# EAGLE design combo - no usb (EAGLE 6.5.0)
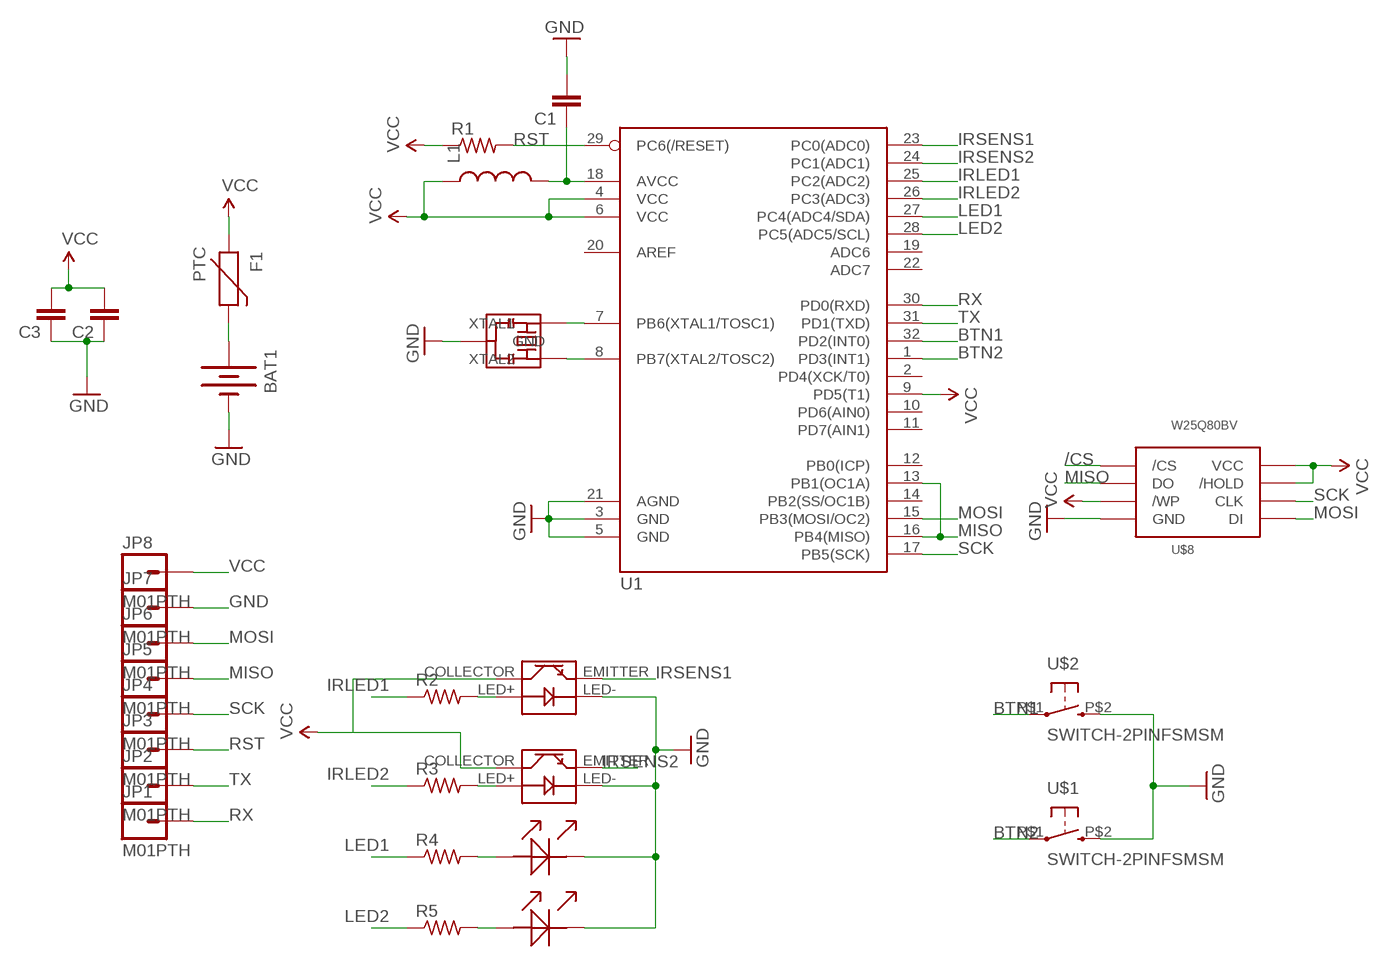
[diagram p0: schematic, sheet 1]

## Parts
BAT1  BATTERYBA2032SM  [BA2032SM]
C1  CAP0805  [0805]
C2  CAP0805  [0805]
C3  CAP0805  [0805]
F1  PTC  [R0805]
JP1  M01PTH  [1X01]
JP2  M01PTH  [1X01]
JP3  M01PTH  [1X01]
JP4  M01PTH  [1X01]
JP5  M01PTH  [1X01]
JP6  M01PTH  [1X01]
JP7  M01PTH  [1X01]
JP8  M01PTH  [1X01]
L1  INDUCTOR0805  [0805]
R1  R-US_M0805  [M0805]
R2  R-US_M0805  [M0805]
R3  R-US_M0805  [M0805]
R4  R-US_M0805  [M0805]
R5  R-US_M0805  [M0805]
U1  ATMEGA328_SMT  [TQFP32-08-THIN]
U$1  SWITCH-2PINFSMSM  [FSMSM-BUTTON]
U$2  SWITCH-2PINFSMSM  [FSMSM-BUTTON]
U$3  IR_SENSORQRE1113  [QRE1113]
U$4  IR_SENSORQRE1113  [QRE1113]
U$5  LED0603  [0603]
U$6  LED0603  [0603]
U$7  RESONATOR_W_CAPS  [AWSCR-CV]
U$8  W25Q80BVSOIC-08  [W25Q80BV-SOIC-208MIL]

## Nets
/CS: U$8./CS
BTN1: U1.32(PD2(INT0)) U$2.P$1
BTN2: U1.1(PD3(INT1)) U$1.P$1
GND: BAT1.- C1.2 C2.1 C3.1 JP7.1 U1.3(GND) U1.5(GND) U1.21(AGND) U$1.P$2 U$2.P$2 U$3.LED- U$4.LED- U$5.2(-) U$6.2(-) U$7.GND U$8.GND
IRLED1: R2.1 U1.25(PC2(ADC2))
IRLED2: R3.1 U1.26(PC3(ADC3))
IRSENS1: U1.23(PC0(ADC0)) U$3.EMITTER
IRSENS2: U1.24(PC1(ADC1)) U$4.EMITTER
LED1: R4.1 U1.27(PC4(ADC4/SDA))
LED2: R5.1 U1.28(PC5(ADC5/SCL))
MISO: JP5.1 U1.13(PB1(OC1A)) U1.16(PB4(MISO)) U$8.DO
MOSI: JP6.1 U1.15(PB3(MOSI/OC2)) U$8.DI
N$1: BAT1.+ F1.2
N$4: U1.7(PB6(XTAL1/TOSC1)) U$7.XTAL1
N$5: U1.8(PB7(XTAL2/TOSC2)) U$7.XTAL2
N$6: C1.1 L1.2 U1.18(AVCC)
N$13: R5.2 U$6.1(+)
N$14: R4.2 U$5.1(+)
N$15: R3.2 U$4.LED+
N$16: R2.2 U$3.LED+
RST: JP3.1 R1.2 U1.29(PC6(/RESET))
RX: JP1.1 U1.30(PD0(RXD))
SCK: JP4.1 U1.17(PB5(SCK)) U$8.CLK
TX: JP2.1 U1.31(PD1(TXD))
VCC: C2.2 C3.2 F1.1 JP8.1 L1.1 R1.1 U1.4(VCC) U1.6(VCC) U1.9(PD5(T1)) U$3.COLLECTOR U$4.COLLECTOR U$8./HOLD U$8./WP U$8.VCC
Unconnected: U1.2(PD4(XCK/T0)) U1.10(PD6(AIN0)) U1.11(PD7(AIN1)) U1.12(PB0(ICP)) U1.14(PB2(SS/OC1B)) U1.19(ADC6) U1.20(AREF) U1.22(ADC7)

## Library data of the parts
BAT1 = Mine:BATTERY: Battery Holders Various common sizes : AA, AAA, 20mm coin cell and 12mm coin cell.
C1-C3 = SparkFun-Capacitors:CAP: Capacitor Standard 0603 ceramic capacitor, and 0.1" leaded capacitor.
F1 = Mine:PTC: Resettable Fuse PTC Resettable Fuse. Spark Fun Electronics SKU : COM-08357
JP1-JP8 = SparkFun-Connectors:M01: Header 1 Standard 1-pin 0.1" header. Use with straight break away headers (SKU : PRT-00116), right angle break away headers (PRT-00553), swiss pins (PRT-00743), machine pins (PRT-00117), and female headers (PRT-00115).
L1 = SparkFun-Passives:INDUCTOR: Inductors Basic Inductor/Choke - 0603 and 1206. Footprints are not proven and vary greatly between part numbers. SRN6045- 33uH, 20% 1.4A SDR0403-560KL - 56uH, 10%, 500mA RMS/740mA peak
R1-R5 = rcl:R-US_: RESISTOR, American symbol
U1 = Mine:ATMEGA328_SMT: 32-Pin Atmega328 part Commonly used on Arduino compatible boards Available in QFP and QFN packages TQFP is IC-09069 QFN is non-stock; PROD_ID: IC-09069; VALUE: ATMEGA328P
U$1 U$2 = Mine:SWITCH-2PIN
U$3 U$4 = Mine:IR_SENSOR
U$5 U$6 = Mine:LED
U$7 = Mine:RESONATOR_W_CAPS
U$8 = Mine:W25Q80BV

## Board
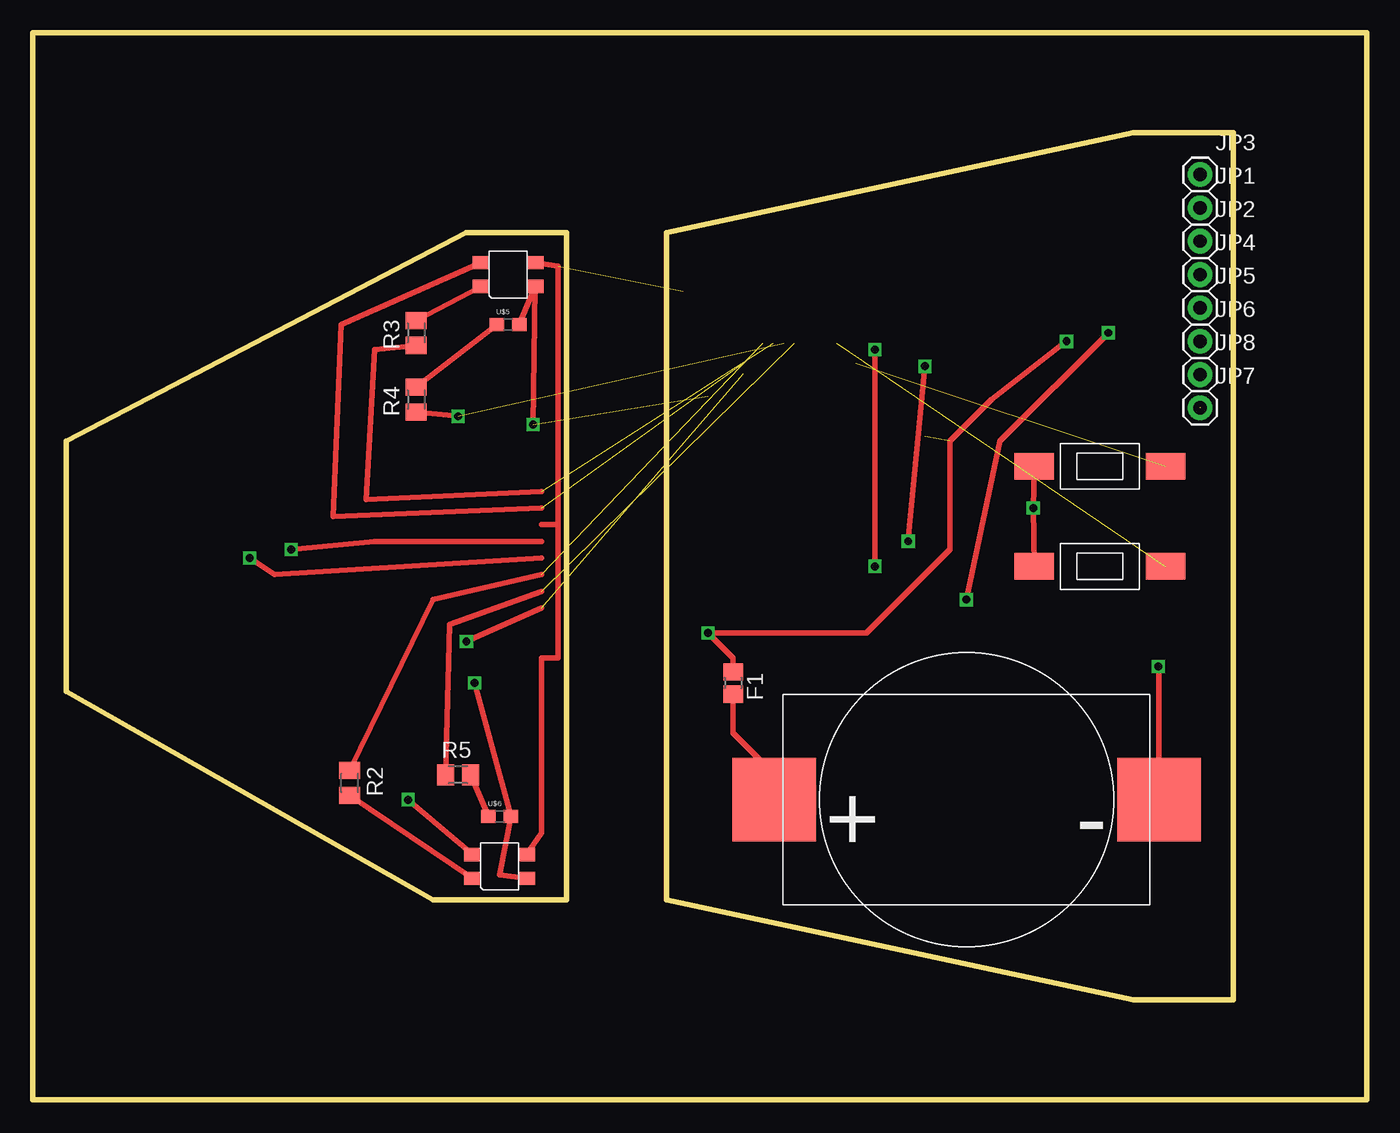
[diagram p1: board, top side]
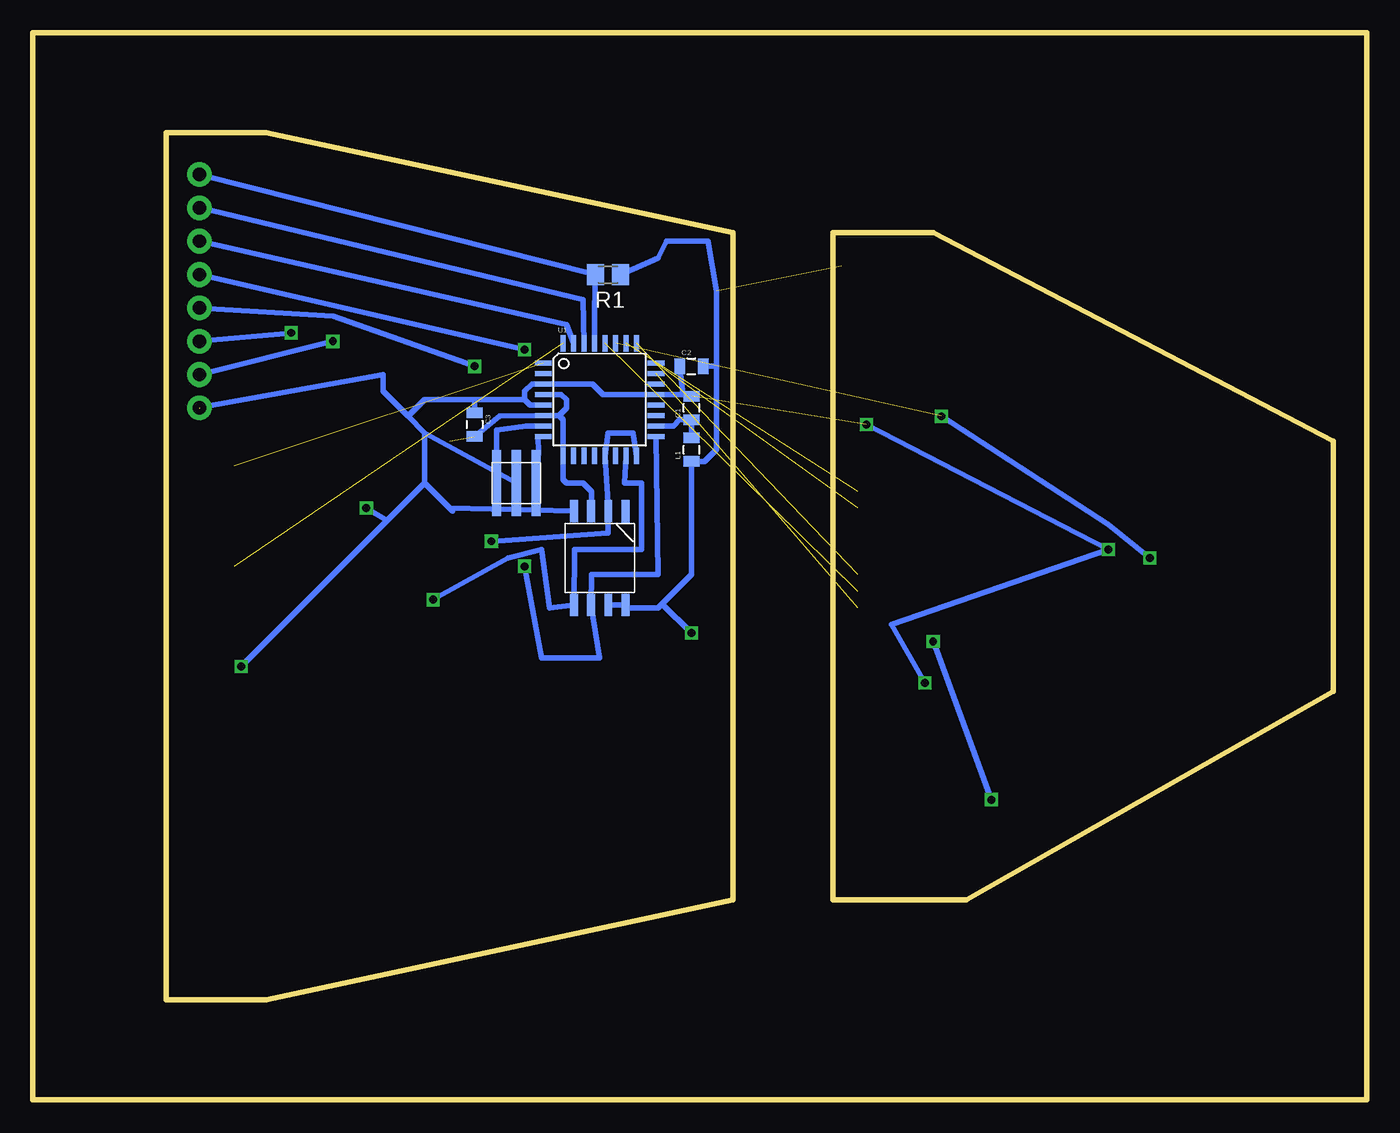
[diagram p2: board, bottom side, seen from below]

Size 101.6 x 81.28 mm. Coordinates in mm from the lower left corner, seen from the top.
Outline: 40.64,66.04 40.64,15.24 30.48,15.24 2.54,31.11 2.54,50.16 33.02,66.04 40.64,66.04
Outline: 48.26,66.04 48.26,15.24 83.82,7.62 91.44,7.62 91.44,73.66 83.82,73.66 48.26,66.04
Outline: 0,0 0,81.28 101.6,81.28 101.6,0 0,0
Copper layers (1*16): Top 0.035mm / dielectric 1.5mm / Bottom 0.035mm
Design rules "default": minimum track width 10mil, minimum drill 24mil, track to track 8mil, track to pad 8mil, pad to pad 8mil, via to via 8mil, smd to smd 8mil, copper to edge 40mil, drill to drill 8mil, minimum pad ring 10mil, minimum via ring 8mil, stop-mask expansion 4mil, vias tented up to drill 0mil, thermal gap 10mil

### Footprints (pad centres in the part's own frame; a part is rotated, then mirrored left to right if it is on the bottom)
BA2032SM = smd 6.35 x 6.35: + 14.656,0; - -14.656,0
0805 = smd 0.8 x 1.2: 1 -0.9,0; 2 0.9,0
R0805 = smd 1.3 x 1.5: 1 -0.85,0; 2 0.85,0
1X01 = drill 1.016 pad 1.88: 1 0,0
M0805 = smd 1.3 x 1.6: 1 -0.95,0; 2 0.95,0
TQFP32-08-THIN = smd 1.27 x 0.381: 1 -4.293,2.8; 2 -4.293,2; 3 -4.293,1.2; 4 -4.293,0.4; 5 -4.293,-0.4; 6 -4.293,-1.2; 7 -4.293,-2; 8 -4.293,-2.8; 17 4.293,-2.8; 18 4.293,-2; 19 4.293,-1.2; 20 4.293,-0.4; 21 4.293,0.4; 22 4.293,1.2; 23 4.293,2; 24 4.293,2.8 | smd 0.381 x 1.27: 9 -2.8,-4.293; 10 -2,-4.293; 11 -1.2,-4.293; 12 -0.4,-4.293; 13 0.4,-4.293; 14 1.2,-4.293; 15 2,-4.293; 16 2.8,-4.293; 25 2.8,4.293; 26 2,4.293; 27 1.2,4.293; 28 0.4,4.293; 29 -0.4,4.293; 30 -1.2,4.293; 31 -2,4.293; 32 -2.8,4.293
FSMSM-BUTTON = smd 3 x 2: P$1 5,0; P$2 -5,0
QRE1113 = smd 1.3 x 1: COLLECTOR 2.05,0.9; EMITTER -2.05,0.9; LED+ -2.05,-0.9; LED- 2.05,-0.9
0603 = smd 1.1 x 1: 1 -0.85,0; 2 0.85,0
AWSCR-CV = smd 0.7 x 5: GND 0,0; XTAL1 -1.5,0; XTAL2 1.5,0
W25Q80BV-SOIC-208MIL = smd 1.7 x 0.605: /CS -3.567,1.965 | smd 1.7 x 0.6: /HOLD 3.575,0.655; /WP -3.575,-0.655; CLK 3.575,-0.655; DI 3.575,-1.965; DO -3.575,0.655; GND -3.575,-1.965; VCC 3.575,1.965

### Placement (x,y rotation side)
BAT1  71.12,22.86 180 top
C1  51.44,52.7 90 bottom
C2  51.44,55.88 0 bottom
C3  67.94,51.44 270 bottom
F1  53.34,31.75 270 top
JP1  88.9,67.94 0 top
JP2  88.9,65.41 0 top
JP3  88.9,70.48 0 top
JP4  88.9,62.87 0 top
JP5  88.9,60.33 0 top
JP6  88.9,57.78 0 top
JP7  88.9,52.7 0 top
JP8  88.9,55.24 0 top
L1  51.44,49.53 90 bottom
R1  57.78,62.87 180 bottom
R2  24.13,24.13 270 top
R3  29.21,58.42 90 top
R4  29.21,53.34 90 top
R5  32.38,24.77 0 top
U1  58.42,53.34 0 bottom
U$1  81.28,48.26 0 top
U$2  81.28,40.64 0 top
U$3  35.56,17.78 0 top
U$4  36.2,62.87 0 top
U$5  36.2,59.05 0 top
U$6  35.56,21.59 0 top
U$7  64.77,46.99 0 bottom
U$8  58.42,41.27 270 bottom

### Tracks (layer width: path | path; a pad name or v marks a point on that pad's centre or on a via)
BTN1  (1 unrouted)
BTN2  (1 unrouted)
GND  (via drill 0.6)  (2 unrouted)
  Top 0.406: BAT1.- 85.78,32.97 v85.72,33.02 | U$1.P$2 v76.2,45.09 U$2.P$2 | U$5.2 U$4.LED- v38.1,51.44 | v19.68,41.91 26.04,42.55 38.73,42.55 | U$3.LED- 35.56,17.14 U$6.2 v33.66,31.75
  Bottom 0.406: 52.07,53.74 U1.21 58.19,53.74 58.98,54.54 U1.3 63.57,54.54 64.14,53.98 64.14,53.34 | 52.07,53.74 51.57,53.74 C1.2 | 88.92,52.73 74.93,55.24 74.93,53.98 73.03,52.07 | U$7.GND 71.75,50.8 | 71.75,50.8 73.03,52.07 | 69.61,44.85 69.85,45.09 | 69.85,45.09 71.75,46.99 | 71.75,46.99 71.75,50.8 | v85.72,33.02 74.61,44.13 | 74.61,44.13 71.75,46.99 | U1.5 63.73,52.94 64.14,53.34 | 64.14,53.34 67.94,53.34 | 67.94,53.34 71.75,53.34 73.03,52.07 | U$8.GND 69.85,45.09 | C2.1 52.07,53.74 | C3.1 67.94,53.34 | v76.2,45.09 74.61,44.13 | v38.1,51.44 v19.68,41.91 36.2,36.2 v33.66,31.75
IRLED1  (1 unrouted)
  Top 0.406: R2.1 30.48,38.1 38.73,40.01
IRLED2  (1 unrouted)
  Top 0.406: R3.1 26.04,57.15 25.4,45.72 38.73,46.35
IRSENS1  (via drill 0.6)  (1 unrouted)
  Top 0.406: v33.02,34.92 38.73,37.47 | U$3.EMITTER v28.57,22.86
  Bottom 0.406: v28.57,22.86 v33.02,34.92
IRSENS2  (1 unrouted)
  Top 0.406: U$4.EMITTER 23.5,59.05 22.86,44.45 38.73,45.09
LED1  (via drill 0.6)  (1 unrouted)
  Top 0.406: R4.1 v32.38,52.07 | v16.51,41.27 18.41,40.01 38.73,41.27
  Bottom 0.406: v32.38,52.07 19.68,43.81 v16.51,41.27
LED2  (1 unrouted)
  Top 0.406: R5.1 31.75,36.2 38.73,38.73
MISO  (via drill 0.6)
  Top 0.406: v67.94,55.88 v66.67,42.55
  Bottom 0.406: U1.16 55.88,50.8 57.78,50.8 U1.13 U$8.DO 57.78,43.18 v66.67,42.55 | JP5.1 78.74,59.69 v67.94,55.88
MOSI  (via drill 0.6)
  Top 0.406: v81.92,58.42 73.66,50.16 v71.12,38.1
  Bottom 0.406: U1.15 56.52,46.99 55.24,46.99 55.24,41.91 60.33,41.91 U$8.DI 62.23,37.47 62.87,41.91 65.41,41.27 v71.12,38.1 | JP6.1 v81.92,58.42
N$1
  Top 0.406: BAT1.+ 56.46,24.82 53.34,27.94 F1.2
N$4
  Bottom 0.406: U1.7 64.04,51.34 66.27,51.03 U$7.XTAL1
N$5
  Bottom 0.406: U1.8 63.12,50.54 63.09,49.3 U$7.XTAL2
N$6
  Bottom 0.406: U1.18 52.8,51.34 52.34,51.8 C1.1 L1.2
N$13
  Top 0.406: R5.2 U$6.1
N$14
  Top 0.406: R4.2 U$5.1
N$15
  Top 0.406: R3.2 U$4.LED+
N$16
  Top 0.406: R2.2 U$3.LED+
RST
  Bottom 0.406: U1.29 58.82,60.24 R1.2 JP3.1
RX
  Bottom 0.406: U1.30 59.69,60.96 JP1.1
SCK  (via drill 0.6)
  Top 0.406: v64.14,57.15 v64.14,40.64
  Bottom 0.406: U1.17 53.98,40.01 59.05,40.01 U$8.CLK 58.42,33.66 62.87,33.66 v64.14,40.64 | JP4.1 v64.14,57.15
TX
  Bottom 0.406: U1.31 60.96,59.05 JP2.1
VCC  (via drill 0.6)  (2 unrouted)
  Top 0.406: F1.1 53.34,33.66 v51.44,35.56 63.5,35.56 69.85,41.91 69.85,50.16 73.03,53.34 v78.74,57.78 | U$4.COLLECTOR 40.01,63.5 40.01,43.81 | 40.01,43.81 38.73,43.81 | U$3.COLLECTOR 38.73,20.32 38.73,33.66 40.01,33.66 40.01,43.81
  Bottom 0.406: 61.52,52.14 U1.6 66.04,52.07 C3.2 | 61.52,52.14 60.96,52.7 60.96,53.34 61.36,53.74 U1.4 | R1.1 53.98,64.14 53.34,65.41 50.16,65.41 49.53,61.59 49.53,55.88 | 49.53,55.88 49.53,49.53 50.43,48.63 L1.1 51.44,40.01 53.66,37.78 | 53.66,37.78 53.98,37.47 56.22,37.47 U$8.VCC U$8./HOLD | v51.44,35.56 53.66,37.78 | 61.52,52.14 61.22,51.84 U1.9 61.22,47.25 60.96,46.99 59.69,46.99 59.05,46.35 59.05,44.87 U$8./WP | v78.74,57.78 JP8.1 | C2.2 49.53,55.88